# EAGLE design WIBL (EAGLE 9.6.2)

## Sheet 1 of 2: Main Logic/Microcontroller/Storage
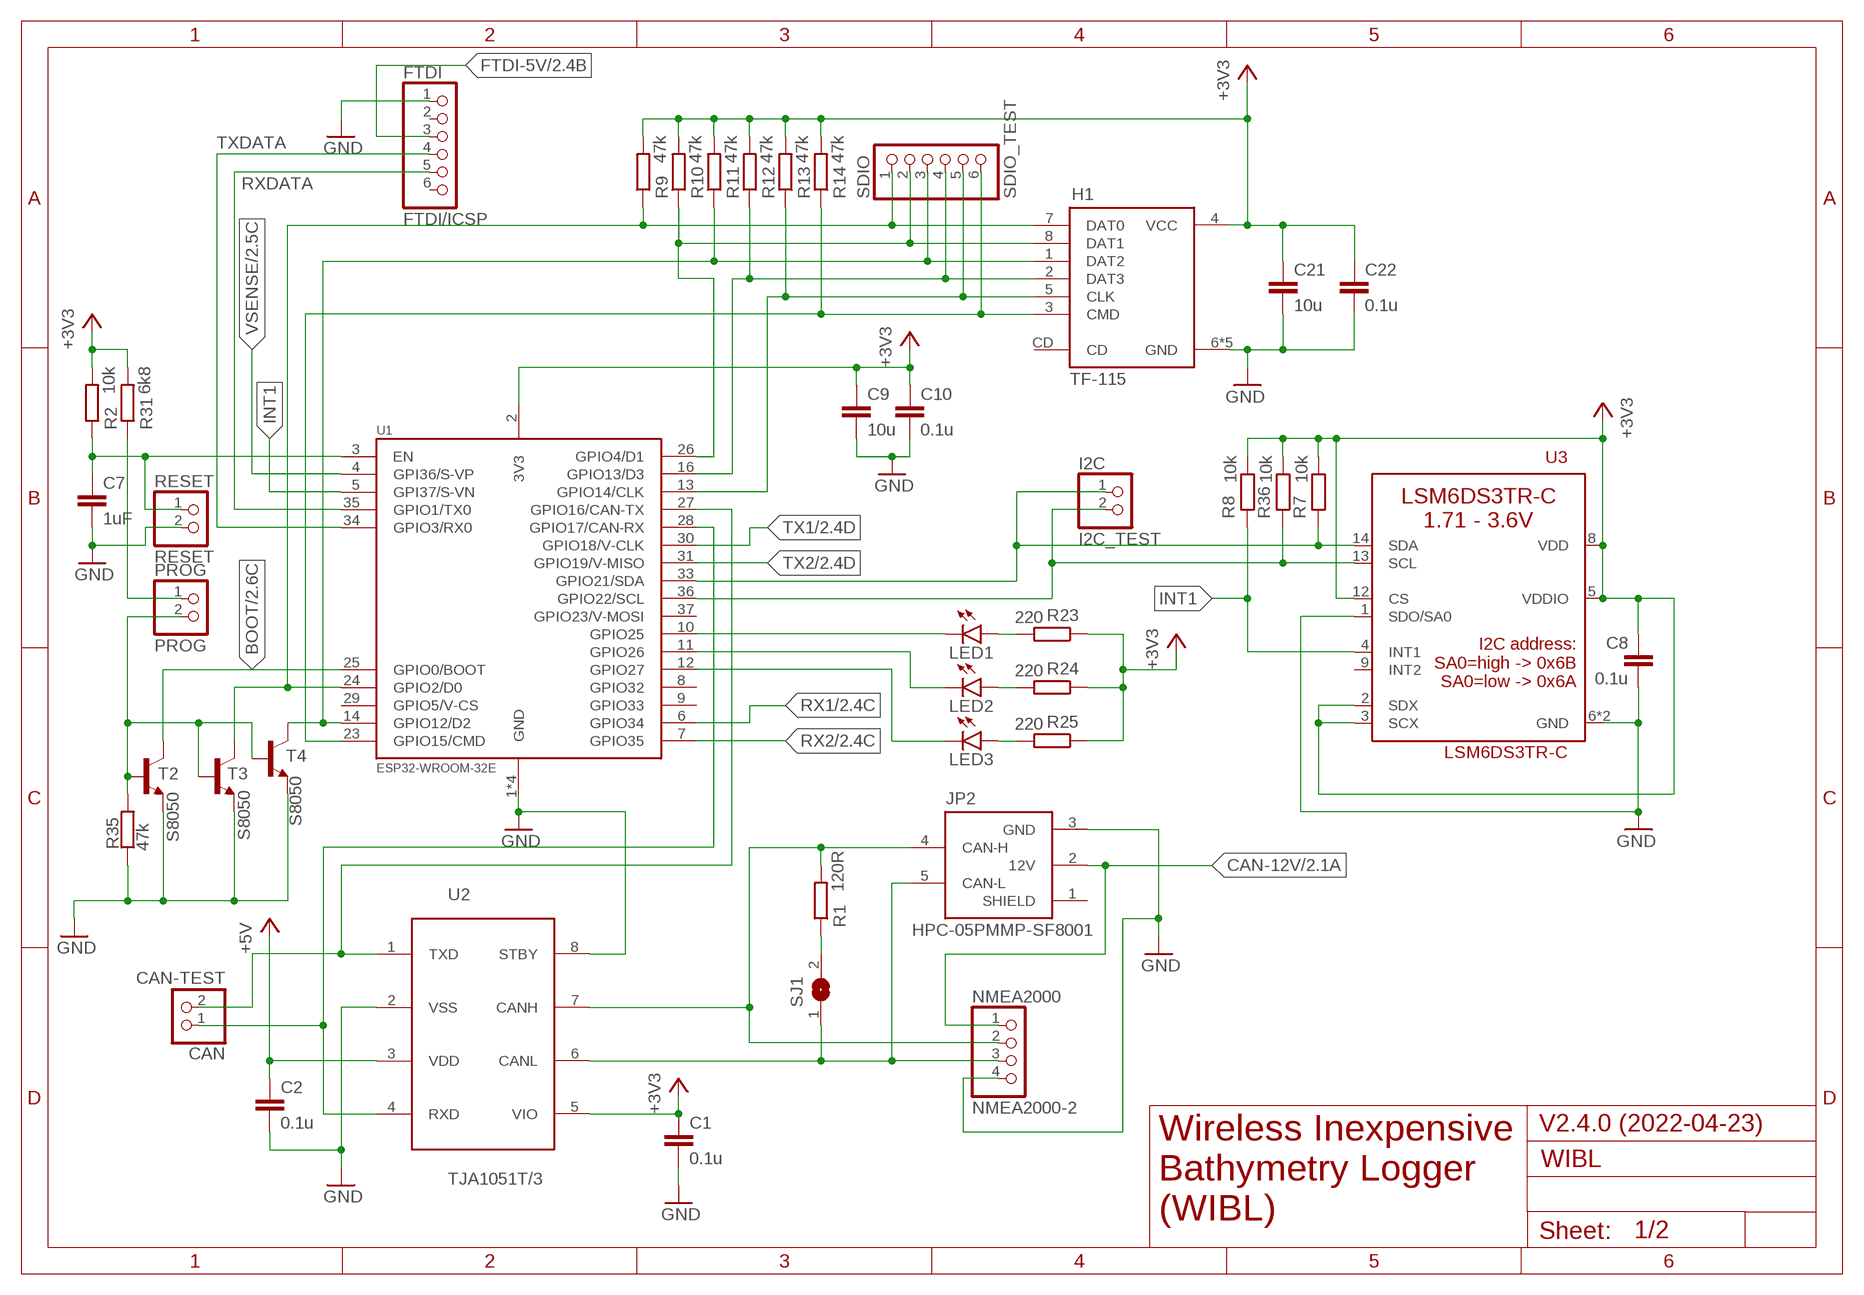
[diagram p0: schematic, sheet 1]

### Parts
C1  0.1u  C-EUC0805  [C0805]
C2  0.1u  C-EUC0805  [C0805]
C7  1uF  C-EUC0805  [C0805]
C8  0.1u  C-EUC0805  [C0805]
C9  10u  C-EUC0805  [C0805]
C10  0.1u  C-EUC0805  [C0805]
C21  10u  C-EUC0805  [C0805]
C22  0.1u  C-EUC0805  [C0805]
CAN  CAN-TEST  PINHD-1X2  [1X02]
FTDI  FTDI/ICSP  PINHD-1X6  [1X06]
H1  TF-115  XUNPU-MICROSD-SOCKET  [XUNPU-MICROSD-SOCKET]
I2C  I2C_TEST  PINHD-1X2  [1X02]
JP2  HPC-05PMMP-SF8001  NMEA2000  [NMEA2000]
LED1  LEDCHIP-LED0603  [CHIP-LED0603]
LED2  LEDCHIP-LED0603  [CHIP-LED0603]
LED3  LEDCHIP-LED0603  [CHIP-LED0603]
NMEA2000  NMEA2000-2  PINHD-1X4  [1X04]
PROG  PROG  PINHD-1X2  [1X02]
R1  120R  R-EU_R0805  [R0805]
R2  10k  R-EU_R0805  [R0805]
R7  10k  R-EU_R0805  [R0805]
R8  10k  R-EU_R0805  [R0805]
R9  47k  R-EU_R0805  [R0805]
R10  47k  R-EU_R0805  [R0805]
R11  47k  R-EU_R0805  [R0805]
R12  47k  R-EU_R0805  [R0805]
R13  47k  R-EU_R0805  [R0805]
R14  47k  R-EU_R0805  [R0805]
R23  220  R-EU_R0805  [R0805]
R24  220  R-EU_R0805  [R0805]
R25  220  R-EU_R0805  [R0805]
R31  6k8  R-EU_R0805  [R0805]
R35  47k  R-EU_R0805  [R0805]
R36  10k  R-EU_R0805  [R0805]
RESET  RESET  PINHD-1X2  [1X02]
SDIO  SDIO_TEST  PINHD-1X6  [1X06]
SJ1  SJ  [SJ]
T2  S8050  BC846  [SOT23]
T3  S8050  BC846  [SOT23]
T4  S8050  BC846  [SOT23]
U1  ESP32-WROOM-32E  [ESPS32-WROOM-32E]
U2  TJA1051T/3  MCP2562T-E/SN  [SOIC8]
U3  LSM6DS3TR-C  [LGA-14-2.5X3MM]

### Nets
+3V3: C1.1 C8.1 C9.1 C10.1 C21.1 C22.1 H1.4(VCC) R2.2 R7.2 R8.2 R9.2 R10.2 R11.2 R12.2 R13.2 R14.2 R23.1 R24.1 R25.1 R31.2 R36.2 U1.2(3V3) U2.5(VIO) U3.2(SDX) U3.3(SCX) U3.5(VDDIO) U3.8(VDD) U3.12(CS) ; also sheet 2
+5V: C2.1 U2.3(VDD) ; also sheet 2
BOOT: T2.3(C) U1.25(GPIO0/BOOT) ; also sheet 2
CAN-12V: JP2.2(12V) NMEA2000.1 ; also sheet 2
FTDI-5V: FTDI.3 ; also sheet 2
GND: C1.2 C2.2 C7.2 C8.2 C9.2 C10.2 C21.2 C22.2 FTDI.1 H1.6(GND) H1.GND1(GND) H1.GND2(GND) H1.GND3(GND) H1.GND4(GND) JP2.3(GND) NMEA2000.4 R35.1 RESET.2 T2.2(E) T3.2(E) T4.2(E) U1.1(GND) U1.15(GND) U1.38(GND) U1.THERM(GND) U2.2(VSS) U2.8(STBY) U3.1(SDO/SA0) U3.6(GND) U3.7(GND) ; also sheet 2
INT1: R8.1 U1.5(GPI37/S-VN) U3.4(INT1)
N$1: JP2.4(CAN-H) NMEA2000.2 R1.2 U2.7(CANH)
N$2: JP2.5(CAN-L) NMEA2000.3 SJ1.1 U2.6(CANL)
N$3: R1.1 SJ1.2
N$4: C7.1 R2.1 RESET.1 U1.3(EN)
N$6: CAN.2 U1.27(GPIO16/CAN-TX) U2.1(TXD)
N$7: CAN.1 U1.28(GPIO17/CAN-RX) U2.4(RXD)
N$10: H1.1(DAT2) R11.1 SDIO.3 T4.3(C) U1.14(GPIO12/D2)
N$11: H1.8(DAT1) R10.1 SDIO.2 U1.26(GPIO4/D1)
N$22: H1.7(DAT0) R9.1 SDIO.1 T3.3(C) U1.24(GPIO2/D0)
N$24: H1.2(DAT3) R12.1 SDIO.4 U1.16(GPIO13/D3)
N$25: H1.5(CLK) R13.1 SDIO.5 U1.13(GPIO14/CLK)
N$26: H1.3(CMD) R14.1 SDIO.6 U1.23(GPIO15/CMD)
N$35: LED1.C U1.10(GPIO25)
N$36: LED2.C U1.11(GPIO26)
N$37: PROG.2 R35.2 T2.1(B) T3.1(B) T4.1(B)
N$38: LED3.C U1.12(GPIO27)
N$39: LED1.A R23.2
N$40: LED2.A R24.2
N$43: PROG.1 R31.1
N$44: LED3.A R25.2
RX1: U1.6(GPIO34) ; also sheet 2
RX2: U1.7(GPIO35) ; also sheet 2
RXDATA: FTDI.5 U1.35(GPIO1/TX0)
SCL: I2C.1 R7.1 U1.33(GPIO21/SDA) U3.14(SDA)
SDA: I2C.2 R36.1 U1.36(GPIO22/SCL) U3.13(SCL)
TX1: U1.30(GPIO18/V-CLK) ; also sheet 2
TX2: U1.31(GPIO19/V-MISO) ; also sheet 2
TXDATA: FTDI.4 U1.34(GPIO3/RX0)
VSENSE: U1.4(GPI36/S-VP) ; also sheet 2
Unconnected: FTDI.2 FTDI.6 H1.CD JP2.1(SHIELD) U1.8(GPIO32) U1.9(GPIO33) U1.29(GPIO5/V-CS) U1.37(GPIO23/V-MOSI) U3.9(INT2)

### Notes on the sheet
- V2.4.0 (2022-04-23)
- Wireless Inexpensive
  Bathymetry Logger
  (WIBL)

## Sheet 2 of 2: NMEA0183 Transceiver/Power Section
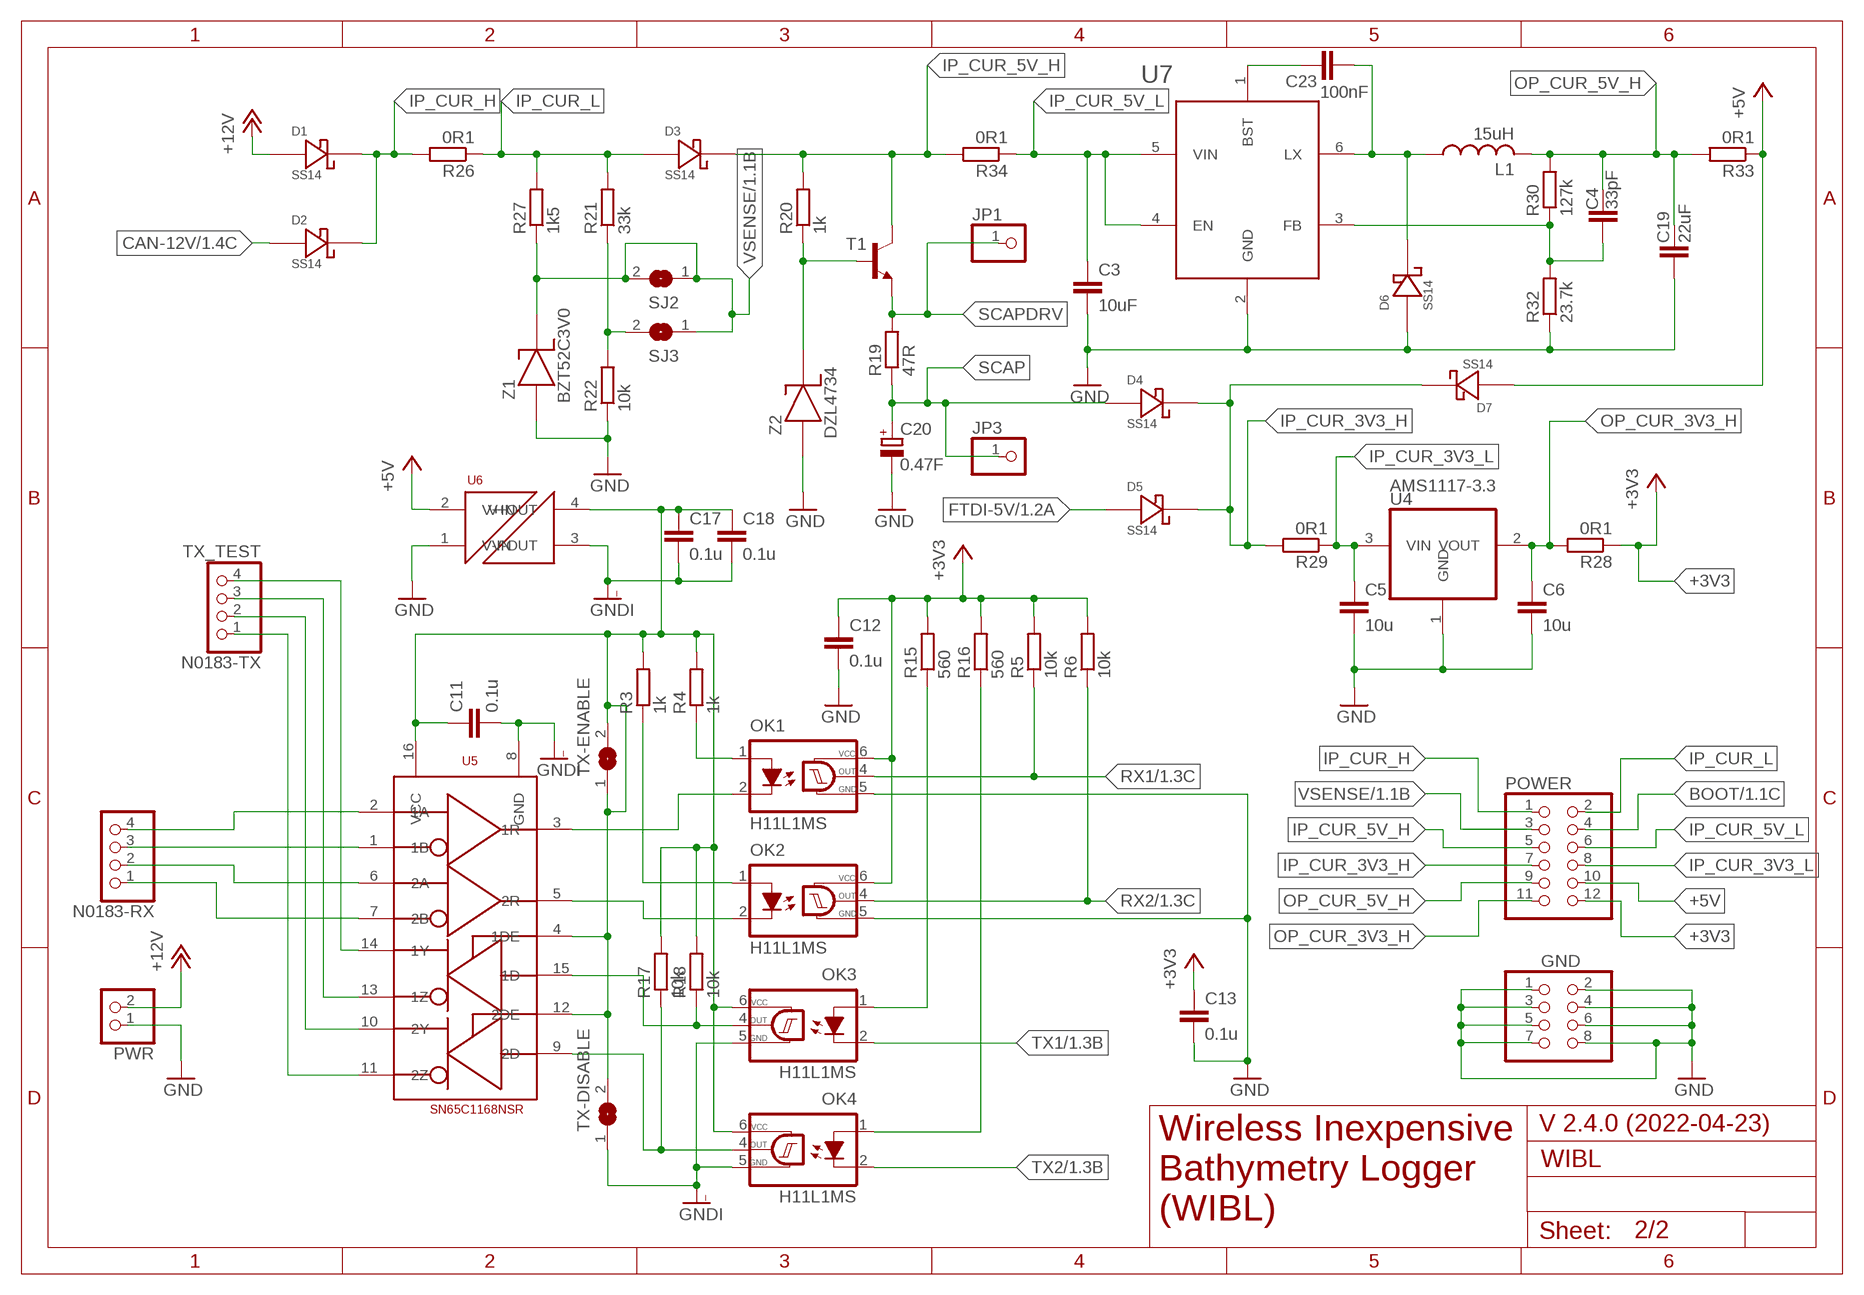
[diagram p1: schematic, sheet 2]

### Parts
C3  10uF  C-EUC1206  [C1206]
C4  33pF  C-EUC0603  [C0603]
C5  10u  C-EUC0805  [C0805]
C6  10u  C-EUC0805  [C0805]
C11  0.1u  C-EUC0805  [C0805]
C12  0.1u  C-EUC0805  [C0805]
C13  0.1u  C-EUC0805  [C0805]
C17  0.1u  C-EUC0805  [C0805]
C18  0.1u  C-EUC0805  [C0805]
C19  22uF  C-EUC0603  [C0603]
C20  0.47F  CPOL-EUP128-50  [P128-50]
C23  100nF  C0402  [C0402]
D1  SS14  [DO-214AC]
D2  SS14  [DO-214AC]
D3  SS14  [DO-214AC]
D4  SS14  [DO-214AC]
D5  SS14  [DO-214AC]
D6  SS14  [DO-214AC]
D7  SS14  [DO-214AC]
GND  PINHD-2X4  [2X04]
JP1  PINHD-1X1  [1X01]
JP3  PINHD-1X1  [1X01]
L1  15uH  MWSA0603S  [MWSA0603S]
N0183-RX  PINHD-1X4  [1X04]
N0183-TX  TX_TEST  PINHD-1X4  [1X04]
OK1  H11L1MS  [DIL6-SMD]
OK2  H11L1MS  [DIL6-SMD]
OK3  H11L1MS  [DIL6-SMD]
OK4  H11L1MS  [DIL6-SMD]
POWER  PINHD-2X6  [2X06]
PWR  PINHD-1X2  [1X02]
R3  1k  R-EU_R0805  [R0805]
R4  1k  R-EU_R0805  [R0805]
R5  10k  R-EU_R0805  [R0805]
R6  10k  R-EU_R0805  [R0805]
R15  560  R-EU_R0805  [R0805]
R16  560  R-EU_R0805  [R0805]
R17  10k  R-EU_R0805  [R0805]
R18  10k  R-EU_R0805  [R0805]
R19  47R  R-EU_R0805  [R0805]
R20  1k  R-EU_R0805  [R0805]
R21  33k  R-EU_R0805  [R0805]
R22  10k  R-EU_R0805  [R0805]
R26  0R1  R-EU_R0603  [R0603]
R27  1k5  R-EU_R0805  [R0805]
R28  0R1  R-EU_R0603  [R0603]
R29  0R1  R-EU_R0603  [R0603]
R30  127k  R-EU_R0603  [R0603]
R32  23.7k  R-EU_R0603  [R0603]
R33  0R1  R-EU_R0603  [R0603]
R34  0R1  R-EU_R0603  [R0603]
SJ2  SJ  [SJ]
SJ3  SJ  [SJ]
T1  BC817-16-NPN-SOT23-BEC  [SOT23-BEC]
TX-DISABLE  SJ  [SJ]
TX-ENABLE  SJ  [SJ]
U4  AMS1117-3.3  REG1117  [SOT223]
U5  SN65C1168NSR  SN65C1168-SOIC  [SOIC16]
U6  RFM-0505S  [RFM-0505S]
U7  BL9352A  [SOT-23-6L]
Z1  BZT52C3V0  [SOD123]
Z2  DZL4734  [SOD-123FL]

### Nets
+3V3: C12.1 C13.1 OK1.6(VCC) OK2.6(VCC) POWER.12 R5.2 R6.2 R15.2 R16.2 R28.1 ; also sheet 1
+5V: D7.A POWER.10 R33.1 U6.2(V+IN) ; also sheet 1
+12V: D1.A PWR.2
BOOT: POWER.4 ; also sheet 1
CAN-12V: D2.A ; also sheet 1
FTDI-5V: D5.A ; also sheet 1
GND: C3.2 C5.2 C6.2 C12.2 C13.2 C19.1 C20.- D6.A GND.1 GND.2 GND.3 GND.4 GND.5 GND.6 GND.7 GND.8 OK1.5(GND) OK2.5(GND) PWR.1 R22.1 R32.1 U4.1(GND) U6.1(V-IN) U7.2(GND) Z1.1(A) Z2.A ; also sheet 1
GNDI: C11.2 C17.2 C18.2 OK3.5(GND) OK4.5(GND) TX-DISABLE.1 U5.8(GND) U6.3(V-OUT)
IP_CUR_3V3_H: D4.K D5.K D7.K POWER.7 R29.2
IP_CUR_3V3_L: C5.1 POWER.8 R29.1 U4.3(VIN)
IP_CUR_5V_H: D3.K POWER.5 R20.2 R34.2 T1.C
IP_CUR_5V_L: C3.1 POWER.6 R34.1 U7.4(EN) U7.5(VIN)
IP_CUR_H: D1.K D2.K POWER.1 R26.2
IP_CUR_L: D3.A POWER.2 R21.2 R26.1 R27.2
N$13: OK1.2(C) U5.3(1R)
N$14: OK2.2(C) U5.5(2R)
N$15: OK1.1(A) R4.1
N$16: OK2.1(A) R3.1
N$17: N0183-RX.4 U5.2(1A)
N$18: N0183-RX.3 U5.1(1B)
N$19: N0183-RX.2 U5.6(2A)
N$20: N0183-RX.1 U5.7(2B)
N$21: C11.1 C17.1 C18.1 OK3.6(VCC) OK4.6(VCC) R3.2 R4.2 R17.2 R18.2 TX-DISABLE.2 TX-ENABLE.1 TX-ENABLE.2 U5.4(1DE) U5.12(2DE) U5.16(VCC) U6.4(V+OUT)
N$27: N0183-TX.4 U5.14(1Y)
N$28: N0183-TX.3 U5.13(1Z)
N$29: N0183-TX.2 U5.10(2Y)
N$30: N0183-TX.1 U5.11(2Z)
N$31: OK3.1(A) R15.1
N$32: OK4.1(A) R16.1
N$33: OK3.4(OUT) R18.1 U5.15(1D)
N$34: OK4.4(OUT) R17.1 U5.9(2D)
N$41: R20.1 T1.B Z2.K
N$42: C23.P$1 U7.1(BST)
N$45: C23.P$2 D6.K L1.P$1 U7.6(LX)
N$46: R21.1 R22.2 SJ3.2
N$48: C4.1 R30.1 R32.2 U7.3(FB)
OP_CUR_3V3_H: C6.1 POWER.11 R28.2 U4.2(VOUT)
OP_CUR_5V_H: C4.2 C19.2 L1.P$2 POWER.9 R30.2 R33.2
RX1: OK1.4(OUT) R5.1 ; also sheet 1
RX2: OK2.4(OUT) R6.1 ; also sheet 1
SCAP: C20.+ D4.A JP3.1 R19.1
SCAPDRV: JP1.1 R19.2 T1.E
TX1: OK3.2(C) ; also sheet 1
TX2: OK4.2(C) ; also sheet 1
VSENSE: POWER.3 R27.1 SJ2.1 SJ2.2 SJ3.1 Z1.2(K) ; also sheet 1

### Notes on the sheet
- V 2.4.0 (2022-04-23)
- Wireless Inexpensive
  Bathymetry Logger
  (WIBL)

## Library data of the parts
C1-C13 C17-C19 C21 C22 = rcl:C-EU: CAPACITOR, European symbol; SPICEPREFIX: C
C20 = rcl:CPOL-EU: POLARIZED CAPACITOR, European symbol; SPICEPREFIX: C
C23 = sb2030_logger:C0402
CAN I2C PROG PWR RESET = pinhead:PINHD-1X2: PIN HEADER
D1-D7 = sb2030_logger:SS14
FTDI SDIO = pinhead:PINHD-1X6: PIN HEADER
GND = pinhead:PINHD-2X4: PIN HEADER
H1 = sb2030_logger:XUNPU-MICROSD-SOCKET: Micro-SD push-push card holder; LCSC C266620, Manufacturer TF-115 (XunPu)
JP1 JP3 = pinhead:PINHD-1X1: PIN HEADER
JP2 = sb2030_logger:NMEA2000
L1 = sb2030_logger:MWSA0603S
LED1-LED3 = led:LED: LED OSRAM: - CHIPLED LG R971, LG N971, LY N971, LG Q971, LY Q971, LO R971, LY R971 LH N974, LH R974 LS Q976, LO Q976, LY Q976 LO Q996 - Hyper CHIPLED LW Q18S LB Q993, LB Q99A, LB R99A - SideLED LS A670, LO A670, LY A670, LG A670, LP A670 LB A673, LV A673, LT A673, LW A673 LH A674 LY A675 LS A676, LA A676, LO A676, LY A676, LW A676 LS A679, LY A679, LG A679 - Hyper Micro SIDELED® LS Y876, LA Y876, LO Y876, LY Y876 LT Y87S - SmartLED LW L88C, LW L88S LB L89C, LB L89S, LG L890 LS L89K, LO L89K, LY L89K LS L896, LA L896, LO L896, LY L896 - TOPLED LS T670, LO T670, LY T670, LG T670, LP T670 LSG T670, LSP T670, LSY T670, LOP T670, LYG T670 LG T671, LOG T671, LSG T671 LB T673, LV T673, LT T673, LW T673 LH T674 LS T676, LA T676, LO T676, LY T676, LB T676, LH T676, LSB T676, LW T676 LB T67C, LV T67C, LT T67C, LS T67K, LO T67K, LY T67K, LW E67C LS E67B, LA E67B, LO E67B, LY E67B, LB E67C, LV E67C, LT E67C LW T67C LS T679, LY T679, LG T679 LS T770, LO T770, LY T770, LG T770, LP T770 LB T773, LV T773, LT T773, LW T773 LH T774 LS E675, LA E675, LY E675, LS T675 LS T776, LA T776, LO T776, LY T776, LB T776 LHGB T686 LT T68C, LB T68C - Hyper Mini TOPLED® LB M676 - Mini TOPLED Santana® LG M470 LS M47K, LO M47K, LY M47K Source: http://www.osram.convergy.de LUXEON: - LUMILED® LXK2-PW12-R00, LXK2-PW12-S00, LXK2-PW14-U00, LXK2-PW14-V00 LXK2-PM12-R00, LXK2-PM12-S00, LXK2-PM14-U00 LXK2-PE12-Q00, LXK2-PE12-R00, LXK2-PE12-S00, LXK2-PE14-T00, LXK2-PE14-U00 LXK2-PB12-K00, LXK2-PB12-L00, LXK2-PB12-M00, LXK2-PB14-N00, LXK2-PB14-P00, LXK2-PB14-Q00 LXK2-PR12-L00, LXK2-PR12-M00, LXK2-PR14-Q00, LXK2-PR14-R00 LXK2-PD12-Q00, LXK2-PD12-R00, LXK2-PD12-S00 LXK2-PH12-R00, LXK2-PH12-S00 LXK2-PL12-P00, LXK2-PL12-Q00, LXK2-PL12-R00 Source: www.luxeon.com KINGBRIGHT: KA-3528ASYC Source: www.kingbright.com
N0183-RX N0183-TX NMEA2000 = pinhead:PINHD-1X4: PIN HEADER
OK1-OK4 = optocoupler:H11L*M: 6-Pin DIP Optocoupler Source: http://www.fairchildsemi.com/ds/H1/H11L2-M.pdf; OC_FARNELL: unknown; OC_NEWARK: unknown
POWER = pinhead:PINHD-2X6: PIN HEADER
R1-R36 = rcl:R-EU_: RESISTOR, European symbol; SPICEPREFIX: R
SJ1-SJ3 TX-DISABLE TX-ENABLE = jumper:SJ: SMD solder JUMPER
T1 = transistor:*-NPN-: NPN Transistror BF959 corrected 2008.03.06
T2-T4 = transistor:BC846: NPN TRANSISTOR
U1 = sb2030_logger:ESP32-WROOM-32E
U2 = sb2030_logger:MCP2562T-E/SN: This is the SMD version of the MCP2562 CAN bus transceiver with Vio pin for digitial IO voltage selection
U3 = LSM6DS3TR-C:LSM6DS3TR-C: Check availability <https://pricing.snapeda.com/parts/LSM6DS3TR-C/STMicroelectronics/view-part?ref=eda>; AVAILABILITY: In Stock; DESCRIPTION: IMUs - Inertial Measurement Units iNEMO 6DoF inertial module, for entry level / mid-tier smart phones and Portable PC platforms; MF: STMicroelectronics; MP: LSM6DS3TR-C; PACKAGE: None; PRICE: None; PURCHASE-URL: https://pricing.snapeda.com/search/part/LSM6DS3TR-C/?ref=eda
U4 = burr-brown:REG1117: 800mA and 1A Low Dropout (LDO) Positive Regulator 1.8V, 2.5V, 2.85V, 3.3V, 5V, and Adj; MPN: REG1117; OC_FARNELL: 1097566; OC_NEWARK: 14P6981
U5 = sb2030_logger:SN65C1168-SOIC
U6 = sb2030_logger:RFM-0505S
U7 = sb2030_logger:BL9352A
Z1 = sb2030_logger:BZT52C3V0
Z2 = sb2030_logger:DZL4734

## Board
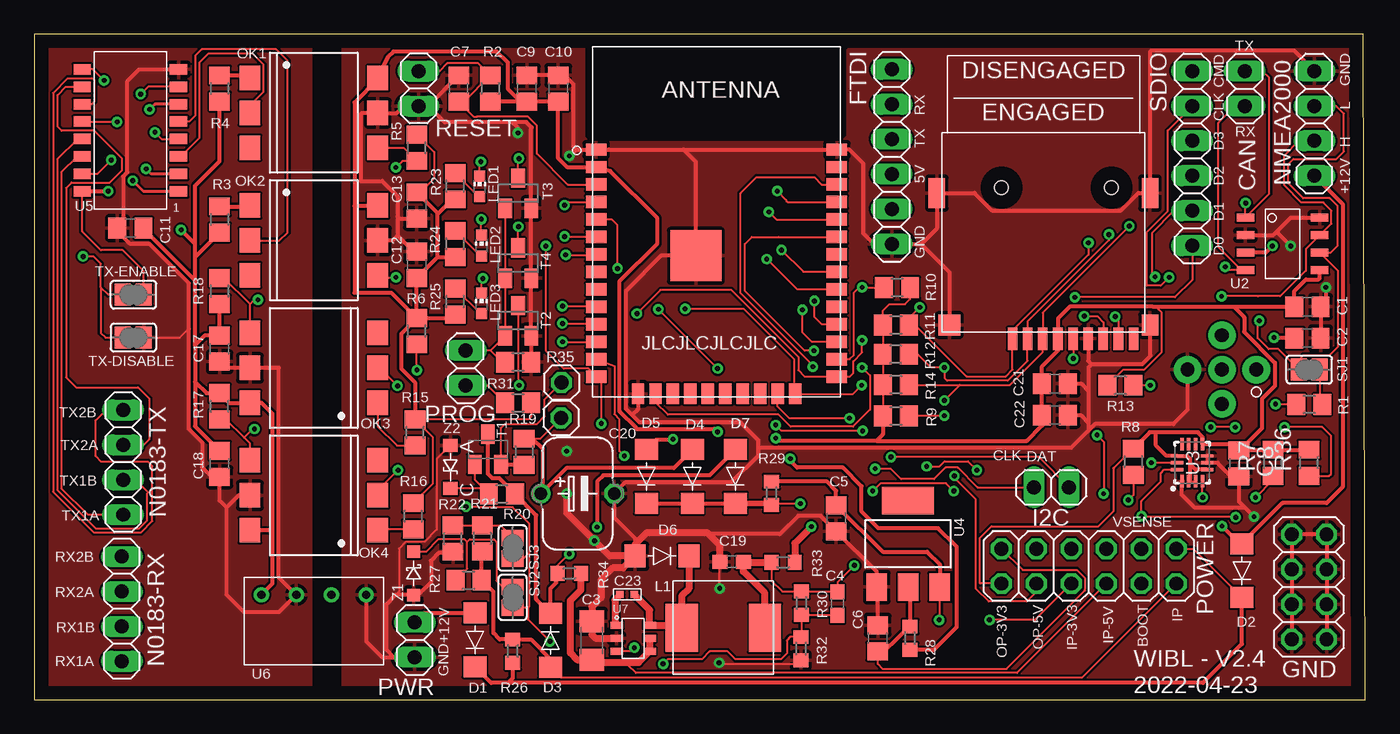
[diagram p2: board, top side]
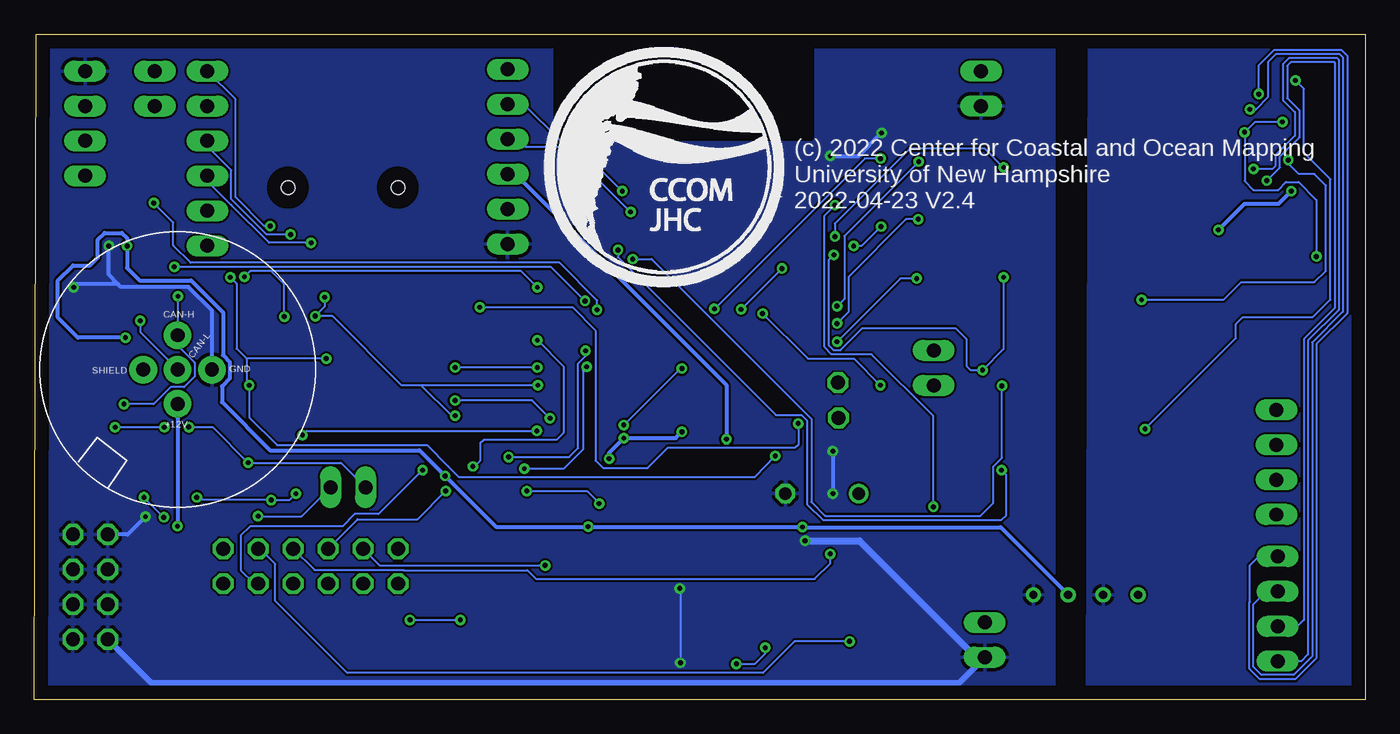
[diagram p3: board, bottom side, seen from below]

Size 96.77 x 48.39 mm. Coordinates in mm from the lower left corner, seen from the top.
Outline: 0,0 96.77,0 96.62,48.39 0,48.39 0,0
Copper layers (1*16): Top 0.035mm / dielectric 1.5mm / Bottom 0.035mm
Design rules "default": minimum track width 6mil, minimum drill 0.35mm, track to track 6mil, track to pad 6mil, pad to pad 6mil, via to via 6mil, smd to smd 6mil, copper to edge 40mil, drill to drill 6mil, minimum pad ring 10mil, minimum via ring 8mil, stop-mask expansion 4mil, vias tented up to drill 0mil, thermal gap 10mil

### Footprints (pad centres in the part's own frame; a part is rotated, then mirrored left to right if it is on the bottom)
C0805 = smd 1.3 x 1.5: 1 -0.95,0; 2 0.95,0
C1206 = smd 1.6 x 1.8: 1 -1.4,0; 2 1.4,0
C0603 = smd 1.1 x 1: 1 -0.85,0; 2 0.85,0
P128-50 = drill 0.914: + -2.667,0 | drill 0.914 octagon: - 2.667,0
C0402 = smd 0.55 x 0.5: P$1 -0.525,0; P$2 0.525,0
1X02 = drill 1.016 long: 1 -1.27,0; 2 1.27,0
DO-214AC = smd 1.524 x 1.676: A 1.956,0; K -1.956,0
1X06 = drill 1.016 long: 1 -6.35,0; 2 -3.81,0; 3 -1.27,0; 4 1.27,0; 5 3.81,0; 6 6.35,0
2X04 = drill 1.016 octagon: 1 -3.81,-1.27; 2 -3.81,1.27; 3 -1.27,-1.27; 4 -1.27,1.27; 5 1.27,-1.27; 6 1.27,1.27; 7 3.81,-1.27; 8 3.81,1.27
XUNPU-MICROSD-SOCKET = smd 0.7 x 1.6: 1 2.25,7.475; 2 1.15,7.475; 3 0.05,7.475; 4 -1.05,7.475; 5 -2.15,7.475; 6 -3.25,7.475; 7 -4.35,7.475; 8 -5.45,7.475; CD -6.55,7.475 | smd 1.2 x 1.5: GND1 -7.75,6.475 | smd 1.2 x 2.2: GND2 -7.75,-3.125; GND3 7.75,-3.125 | smd 1.6 x 1.5: GND4 6.85,6.475 | hole 1: -4.95,-3.525; 3.05,-3.525
1X01 = drill 1.016 octagon: 1 0,0
NMEA2000 = drill 1 pad 2: 1 2.5,0; 2 0,-2.5; 3 -2.5,0; 4 0,2.5; 5 0,0
MWSA0603S = smd 2.35 x 3.5: P$1 -3.025,0; P$2 3.025,0
CHIP-LED0603 = smd 0.8 x 0.8: A 0,-0.75; C 0,0.75
1X04 = drill 1.016 long: 1 -3.81,0; 2 -1.27,0; 3 1.27,0; 4 3.81,0
DIL6-SMD = smd 1.78 x 1.52: 1 -2.54,-4.645; 2 0,-4.645; 3 2.54,-4.645; 4 2.54,4.645; 5 0,4.645; 6 -2.54,4.645
2X06 = drill 1.016 octagon: 1 -6.35,-1.27; 2 -6.35,1.27; 3 -3.81,-1.27; 4 -3.81,1.27; 5 -1.27,-1.27; 6 -1.27,1.27; 7 1.27,-1.27; 8 1.27,1.27; 9 3.81,-1.27; 10 3.81,1.27; 11 6.35,-1.27; 12 6.35,1.27
R0805 = smd 1.3 x 1.5: 1 -0.95,0; 2 0.95,0
R0603 = smd 1 x 1.1: 1 -0.85,0; 2 0.85,0
SJ = smd 1.168 x 1.6: 1 -0.762,0; 2 0.762,0
SOT23-BEC = smd 1 x 1.4: B -0.95,-1.1; C 0,1.1; E 0.95,-1.1
SOT23 = smd 1 x 1.4: 1 -0.95,-1.1; 2 0.95,-1.1; 3 0,1.1
ESPS32-WROOM-32E = smd 1.5 x 0.9: 1 -8.75,8.34; 2 -8.75,7.07; 3 -8.75,5.8; 4 -8.75,4.53; 5 -8.75,3.26; 6 -8.75,1.99; 7 -8.75,0.72; 8 -8.75,-0.55; 9 -8.75,-1.82; 10 -8.75,-3.09; 11 -8.75,-4.36; 12 -8.75,-5.63; 13 -8.75,-6.9; 14 -8.75,-8.17; 25 8.75,-8.17; 26 8.75,-6.9; 27 8.75,-5.63; 28 8.75,-4.36; 29 8.75,-3.09; 30 8.75,-1.82; 31 8.75,-0.55; 32 8.75,0.72; 33 8.75,1.99; 34 8.75,3.26; 35 8.75,4.53; 36 8.75,5.8; 37 8.75,7.07; 38 8.75,8.34 | smd 0.9 x 1.5: 15 -5.71,-9.42; 16 -4.44,-9.42; 17 -3.17,-9.42; 18 -1.9,-9.42; 19 -0.63,-9.42; 20 0.64,-9.42; 21 1.91,-9.42; 22 3.18,-9.42; 23 4.45,-9.42; 24 5.71,-9.42 | smd 3.7 x 3.7: THERM -1.5,0.62
SOIC8 = smd 0.6 x 1.27: 1 -1.905,-2.7; 2 -0.635,-2.7; 3 0.635,-2.7; 4 1.905,-2.7; 5 1.905,2.7; 6 0.635,2.7; 7 -0.635,2.7; 8 -1.905,2.7
LGA-14-2.5X3MM = smd 0.9 x 0.25: 1 -1.35,0.75; 2 -1.35,0.25; 3 -1.35,-0.25; 4 -1.35,-0.75; 8 1.35,-0.75; 9 1.35,-0.25; 10 1.35,0.25; 11 1.35,0.75 | smd 0.25 x 0.9: 5 -0.5,-1.1; 6 0,-1.1; 7 0.5,-1.1; 12 0.5,1.1; 13 0,1.1; 14 -0.5,1.1
SOT223 = smd 1.499 x 2.007: 1 -2.261,-3.15; 2 0.025,-3.15; 3 2.311,-3.15 | smd 3.81 x 2.007: 4 0,3.15
SOIC16 = smd 1.27 x 0.762: 1 -3.505,5.08; 2 -3.505,3.81; 3 -3.505,2.54; 4 -3.505,1.27; 5 -3.505,0; 6 -3.505,-1.27; 7 -3.505,-2.54; 8 -3.505,-3.81; 9 3.505,-3.81; 10 3.505,-2.54; 11 3.505,-1.27; 12 3.505,0; 13 3.505,1.27; 14 3.505,2.54; 15 3.505,3.81; 16 3.505,5.08
RFM-0505S = drill 0.6: 1 -3.81,0; 2 -1.27,0; 3 1.27,0; 4 3.81,0
SOT-23-6L = smd 0.9 x 0.5: 1 -1.2,0.95; 2 -1.2,0; 3 -1.2,-0.95; 4 1.2,-0.95; 5 1.2,0; 6 1.2,0.95
SOD123 = smd 0.9 x 0.95: 1 -1.575,0; 2 1.575,0
SOD-123FL = smd 0.95 x 1.05: A -1.575,0; K 1.575,0

### Placement (x,y rotation side)
C1  92.58,28.57 0 top
C2  92.58,26.29 0 top
C3  40.54,4.31 90 top
C4  58.41,6.97 90 top
C5  58.31,13.18 270 top
C6  61.33,4.46 90 top
C7  30.86,44.45 90 top
C8  87.59,17.18 270 top
C9  35.81,44.45 90 top
C10  38.1,44.45 90 top
C11  6.99,34.29 180 top
C12  27.81,31.62 90 top
C13  27.81,35.94 270 top
C17  13.46,25.53 270 top
C18  13.46,17.14 270 top
C19  50.71,10.02 0 top
C20  39.5,14.99 0 top
C21  74.22,22.97 0 top
C22  74.22,20.69 0 top
C23  43.1,7.65 0 top
CAN  88.01,44.45 90 top
D1  32.04,4.34 90 top
D2  87.82,9.37 90 top
D3  37.53,4.31 270 top
D4  47.85,16.23 90 top
D5  44.5,16.23 90 top
D6  45.64,10.44 180 top
D7  50.98,16.23 90 top
FTDI  62.36,39.5 90 top
GND  92.7,8.19 90 top
H1  73.38,33.72 180 top
I2C  73.96,15.44 180 top
JP1  38.33,23.05 0 top
JP2  86.36,24 0 top
JP3  38.29,20.5 0 top
L1  50.1,5.22 0 top
LED1  32.38,37.34 0 top
LED2  32.51,33.02 0 top
LED3  32.51,28.83 0 top
N0183-RX  6.36,6.59 270 top
N0183-TX  6.45,17.26 270 top
NMEA2000  93.09,41.91 90 top
OK1  20.32,42.67 270 top
OK2  20.32,33.4 270 top
OK3  20.32,24.13 90 top
OK4  20.32,14.86 90 top
POWER  76.68,9.7 180 top
PROG  31.37,24.13 90 top
PWR  27.66,4.34 90 top
R1  92.71,21.46 180 top
R2  33.15,44.45 270 top
R3  13.46,34.92 270 top
R4  13.46,44.45 270 top
R5  27.81,40.13 90 top
R6  27.81,26.8 90 top
R7  90.07,17.22 90 top
R8  79.92,17.3 90 top
R9  62.65,20.62 180 top
R10  62.74,29.97 0 top
R11  62.65,27.24 180 top
R12  62.64,25.11 180 top
R13  78.98,22.86 180 top
R14  62.66,22.9 180 top
R15  27.69,19.43 90 top
R16  27.56,13.34 90 top
R17  13.46,21.34 90 top
R18  13.46,29.72 270 top
R19  35.61,18.02 270 top
R20  34,14.96 0 top
R21  32.58,11.72 270 top
R22  30.44,11.71 90 top
R23  30.61,37.34 90 top
R24  30.61,33.15 90 top
R25  30.61,28.96 90 top
R26  34.79,3.52 270 top
R27  31.58,8.69 0 top
R28  63.68,4.46 90 top
R29  53.61,15 270 top
R30  55.78,7.01 90 top
R31  35.18,21.59 0 top
R32  55.74,3.7 90 top
R33  54.44,9.98 180 top
R34  38.9,9.18 180 top
R35  35.17,24.54 180 top
R36  92.7,17.22 90 top
RESET  27.94,44.45 270 top
SDIO  84.2,39.37 90 top
SJ1  92.71,24 0 top
SJ2  34.79,7.43 90 top
SJ3  34.79,11.01 90 top
T1  32.98,18.2 0 top
T2  35.18,27.56 0 top
T3  35.18,36.83 0 top
T4  35.18,31.75 0 top
TX-DISABLE  7.2,26.33 180 top
TX-ENABLE  7.2,29.45 0 top
U1  49.61,31.66 0 top
U2  90.77,33.15 270 top
U3  84.2,17.22 90 top
U4  63.53,11.33 0 top
U5  6.99,42.04 180 top
U6  20.32,7.62 180 top
U7  43.55,4.46 0 top
Z1  27.58,9.18 90 top
Z2  30.25,16.92 270 top

### Tracks (layer width: path | path; a pad name or v marks a point on that pad's centre or on a via)
+3V3  (via drill 0.35)
  Top 0.152: R31.2 36.13,20.58 35.93,20.38 R15.2 28.96,19.11 28.96,15.68 R16.2 | R5.2 29.07,39.83 29.07,37.91 27.93,36.77 | R13.2 79.17,24 80.7,24 81.98,25.29 81.98,28.14 81.76,28.37 | 81.76,28.37 81.76,28.57 | 81.76,28.37 81.55,28.57 81.34,28.57 | POWER.12 68.77,8.43 68.77,11.77 69.61,12.61 77.38,12.61 78.45,13.68 78.45,16.84 78.51,16.84 R8.2 | R9.2 61.71,20.64 R14.2 61.71,25.08 R12.2 61.72,25.14 61.72,27.22 R11.2 61.7,28.29 62.18,28.77 63.32,28.77 63.69,29.13 R10.2 | C8.1 87.61,18.15 87.63,18.17 87.71,18.17 | U3.2 84.01,15.87 U3.3
  Top 0.305: 23.28,35.9 23.28,43.43 24.96,45.12 OK1.6 25.7,46.73 26.11,47.14 33.63,47.14 34.42,46.35 34.42,44.45 35.37,43.5 C9.1 | 23.28,35.9 24.93,35.9 OK2.6 | R6.2 C12.1 29.34,32.2 | 23.28,35.9 23.28,29.6 25.96,29.6 R6.2 | 29.34,32.2 29.34,35.37 | 29.34,35.37 27.93,36.77 C13.1 | R6.2 26.67,26.6 26.67,24.08 27.69,23.06 R15.2 | 61.23,18.82 54.1,18.82 v53.91,19.01 | 87.21,28.57 81.76,28.57 81.34,28.57 75.29,28.57 74.43,27.72 H1.4 74.43,25.4 73.27,24.23 C21.1 C22.1 73.27,19.93 72.16,18.82 61.23,18.82 | 87.21,28.57 C1.1 91.63,29.72 92.47,30.56 93.38,30.56 93.47,30.64 U2.5 | 87.21,28.57 87.97,27.81 87.97,26.75 90.22,24.5 90.22,22.82 89.27,21.87 89.27,19.73 87.71,18.17 R7.2 R36.2 | R9.2 61.7,19.29 61.23,18.82 | C9.1 C10.1 38.1,39.37 38.73,38.73 U1.2 41.87,38.44 45.3,35.01 45.3,33.19 42.56,30.44 42.56,20.96 43.78,19.74 43.78,19.7 49.45,19.7 v49.68,19.47 | C9.1 R2.2 | v54.98,17.53 54.98,17.37 55.47,16.88 58.79,16.88 60.16,15.51 60.16,13.68 61.38,12.46 65.72,12.46 67.06,11.12 67.06,5.26 65.41,3.61 R28.1 | 29.34,32.2 R24.1 | 87.19,18.57 87.61,18.15 | R6.2 30.35,27.75 R25.1 | 29.34,35.37 29.39,35.37 30.41,36.39 R23.1 | 84.01,17.14 84.01,17.53 83.81,17.72 U3.12 82.33,17.72 81.57,18.48 81.57,19.43 | 84.01,17.14 84.01,15.87 | U3.5 84.43,16.72 84.01,17.14 | 87.16,18.57 C8.1 | C8.1 87.15,18.57 U3.8 84.95,19.1 84.62,19.43 81.57,19.43 | 81.57,19.43 81.11,19.43 R8.2
  Bottom 0.305: v49.68,19.47 50.14,19.01 v53.91,19.01 54.98,17.95 v54.98,17.53
+5V  (via drill 0.35)
  Top 0.152: POWER.10 72.87,7.84 72.16,7.12 69.41,7.12 68.47,8.06 68.47,14.55 66.83,16.19
  Top 0.305: 66.83,16.19 v66.9,16.27 | v90.14,26.33 91.59,26.33 C2.1 | v90.03,32.99 89.55,32.51 U2.3 | D7.A 49.1,16.31 41.38,16.31 40.92,15.85 v40.92,12.54
  Top 0.508: v56.5,12.57 55.3,11.37 R33.1
  Bottom 0.305: v90.14,26.33 93.61,26.33 95.06,27.77 95.06,30.48 93.95,31.59 92.73,31.59 92.16,32.16 92.16,33.45 91.67,33.95 90.41,33.95 90.03,33.57 v90.03,32.99 90.03,31.39 89.12,30.48 85.38,30.48 83.06,28.16 83.06,25.05 82.56,24.54 82.56,23.36 83.13,22.78 83.13,21.64 79.63,18.14 68.77,18.14 v66.9,16.27 63.21,12.57 v56.5,12.57 40.96,12.57 v40.92,12.54 26.5,12.54 U6.2
+12V
  Top 0.305: PWR.2 28.35,6.3 D1.A
BOOT  (via drill 0.35)
  Top 0.152: T2.3 35.18,23.18 35.2,23.16 35.2,22.9 v35.25,22.86 | v60.2,26.14 60.2,25.25 59.55,24.6 59.55,23.74 59.3,23.49 U1.25 56.02,23.5 55.55,23.96 55.55,24.93 50.69,29.79 45.53,29.79 v43.81,28.08 | v64.88,16.95 65.8,16.95 66.18,17.34 67.89,17.34 v68.54,16.69
  Bottom 0.152: v35.25,22.86 37.19,24.8 40.53,24.8 v43.81,28.08 | v60.2,26.14 58.29,24.23 58.29,19.39 58.79,18.9 64.08,18.9 64.35,18.63 64.35,17.37 64.77,16.95 v64.88,16.95 | v68.54,16.69 71.74,13.49 73.5,13.49 74.37,12.61 81.08,12.61 81.76,11.93 81.76,9.41 80.78,8.43 POWER.4
CAN-12V  (via drill 0.35)
  Top 0.305: NMEA2000.1 95.15,36.04 95.15,15.47 93.97,14.29 90.75,14.29 87.82,11.35 D2.A 87.66,11.33 v86.37,12.61
  Bottom 0.305: JP2.2 86.36,12.62 v86.37,12.61
FTDI-5V  (via drill 0.35)
  Top 0.305: v46.44,18.94 46.41,18.9 45.21,18.9 D5.A
  Bottom 0.305: FTDI.3 61.77,38.23 46.44,22.9 v46.44,18.94
GND  (via drill 0.35)
  Top 0.152: Z2.A 29.26,17.5 29.26,12.36 28.36,11.47 27.01,11.47 26.52,10.97 26.52,7.85 26.28,7.61 | R32.1 55.45,2.55 49.99,2.55 49.87,2.67 v49.8,2.67 | v49.84,8.08 49.84,9.99 C19.1 | C8.2 87.02,16.23 | 83.44,15.86 U3.1 | U1.1 41,40
  Top 0.305: 52.65,18.33 52.65,17.75 50.71,15.81 42.99,15.81 C20.- 42.16,13.23 43.69,11.71 D6.A | 52.65,18.33 52.65,18.86 51.36,20.16 44.01,20.16 43.47,20.69 | 43.47,20.69 43.02,21.14 43.02,29.72 45.58,32.28 U1.THERM 48.11,39.1 47.21,40 | 39.43,40.01 39.2,40.23 39.2,44.77 38.57,45.4 C10.2 C9.2 | C7.2 28.64,43.18 | 28.64,43.18 RESET.2 26.84,43.18 26.33,42.67 OK1.5 23.81,42.67 23.74,42.6 23.74,37.72 25.3,37.72 26.4,36.61 26.4,35.13 | 34.75,42.01 35.76,42.01 36.16,41.6 36.13,41.58 T3.2 T4.2 T2.2 R35.1 | 34.75,42.01 32.33,42.01 32.31,41.99 29.84,41.99 28.64,43.18 | 26.4,35.13 26.54,34.99 C13.2 | 26.4,35.13 26.4,33.76 | OK2.5 26.05,33.4 26.4,33.76 | 26.4,33.76 27.59,32.57 C12.2 | 64.5,33.15 FTDI.1 61.04,33.15 60.27,33.91 60.27,39 59.27,40 U1.38 47.21,40 | 64.5,33.15 65.66,34.3 65.66,36.82 H1.GND3 68.37,36.84 69.64,35.58 79.02,35.58 80.29,36.84 H1.GND2 81.13,47.11 81.23,47.21 91.61,47.21 NMEA2000.4 | 64.5,33.15 66.56,31.09 66.56,27.27 H1.GND4 | 52.65,18.33 75.4,18.33 76.66,19.58 | JP2.3 83.86,21.07 82.83,20.04 77.11,20.04 76.66,19.58 | 76.66,22.44 76.66,24.15 76.89,24.38 | 76.66,22.44 76.66,20.12 | 76.66,20.12 76.66,19.58 | 76.89,24.38 80.54,24.38 81.16,25 81.16,27.22 H1.GND1 | U2.2 90.09,33.78 90.47,34.16 | 90.47,34.16 91.36,35.05 U2.8 | v93.92,29.98 93.92,28.96 C1.2 C2.2 | v91.36,32.99 90.47,33.88 90.47,34.16 | H1.6 76.63,24.64 76.89,24.38 | 39.43,40.01 U1.1 | U1.1 | U1.15 43.9,21.11 43.47,20.69 | U1.1 41.76,40.01 | 41,40 47.21,40 | C22.2 76.09,20.69 76.66,20.12 | C21.2 76.12,22.97 76.66,22.44 | U6.1 24.13,4.22 25.27,3.07 26.14,3.07 | 26.14,3.07 PWR.1 | R22.1 30.35,10.67 29.41,10.67 28.84,10.1 28.84,8.53 27.91,7.61 Z1.1 26.28,7.61 25.57,6.9 25.57,3.65 26.14,3.07
  Top 0.305: C6.2 61.33,8.12 U4.1 61.27,9.27 C5.2 57.16,13.37 55.55,13.37 54.22,12.04 49.03,12.04 48.96,12.12 | GND.2 GND.4 GND.6 GND.8 GND.7 GND.5 GND.3 GND.1 | 39.43,40.01 38.97,39.54 v38.89,39.54 | v35.17,41.22 35.17,41.59 34.75,42.01 | 87.02,16.23 86.03,17.22 U3.6 U3.7 | C8.2 87.59,14.4 88.05,13.95 | v88.7,13.3 88.05,13.95 | 88.05,13.95 84.39,13.95 83.44,14.9 83.44,15.86
  Top 0.508: D6.A 42.81,9.56 42.06,9.56 41.22,8.72 41.22,7.43 40.54,6.74 C3.2 40.54,4.72 40.8,4.46 U7.2 | D6.A 41.83,10.44 v40.73,11.54 38.71,13.56 v38.71,14.97 | C19.1 49.86,11.21 48.96,12.12 44.5,12.12 43.69,11.3 D6.A
  Bottom 0.152: v49.84,8.08 49.8,8.04 v49.8,2.67
  Bottom 0.305: JP2.3 83.86,28.31 85.57,30.02 90.49,30.02 90.7,30.23 | 90.7,30.23 91.36,30.9 v91.36,32.99 | 90.7,30.23 93.67,30.23 v93.92,29.98 | v38.89,39.54 36.85,39.54 v35.17,41.22 | v88.7,13.3 89.99,12 GND.8 | v38.71,18.06 v38.71,14.97
  Bottom 0.406: GND.2 88.27,1.22 29.52,1.22 PWR.1
  Bottom 0.508: v40.73,11.54 36.77,11.54 28.3,3.07 PWR.1
  pour Top: 22.52,48.39 39.97,48.39 39.97,40.96 40.35,40.58 58.67,40.58 58.79,40.69 59.13,41.03 59.13,47.28 60.12,48.27 96.51,48.27 96.51,0 22.4,0 22.4,48.23 22.52,48.35
  pour Bottom: 22.56,48.31 39.2,48.31 40.01,47.51 40.01,40.77 40.23,40.54 58.52,40.54 59.09,41.11 59.09,47.32 60.05,48.27 96.62,48.27 96.62,0.08 22.56,0.08
GNDI
  Top 0.152: TX-DISABLE.1 10.58,26.33 11.23,26.98
  Top 0.305: 13.97,13.97 13.97,7.62 15.24,6.35 17.78,6.35 U6.3 17.78,8.89 17.78,24.13 OK3.5 13.91,24.13 C17.2 | 13.97,13.97 14.86,14.86 OK4.5 | 13.97,13.97 13.46,14.48 C18.2 12.89,16.2 12.19,16.89 12.19,18.72 11.23,19.68 11.23,26.98 11.23,30.29 8.37,33.15 6.99,33.15 6.04,34.1 C11.2 6.45,34.71 6.45,38.05 6.76,38.35 6.76,44.98 7.62,45.85 U5.8
  pour Top: 19.77,0.04 -0.04,0.04 -0.04,48.54 20,48.54 20.12,48.65 20.12,0.34 19.77,0
  pour Bottom: 0.11,48.39 20.12,48.39 20.27,0.08 20.15,-0.04 0.15,-0.04 0,0.11 0,48.12 0.23,48.35
INT1  (via drill 0.35)
  Top 0.152: 84.96,15.87 U3.4 84.95,14.72 v84.96,14.7 | v79.55,14.52 79.92,14.88 R8.1 | v77.28,19.24 77.76,18.75 v77.76,14.97 | v53.91,19.96 54.33,19.54 v60.23,19.54 | v42.41,31.36 42.41,34.52 42,34.92 U1.5 | v49.68,24.08 v45.38,28.38
  Bottom 0.152: v77.76,14.97 78.22,14.52 v79.55,14.52 84.78,14.52 v84.96,14.7 | v77.28,19.24 76.97,19.55 v60.24,19.55 v60.23,19.54 | v53.91,19.96 49.8,24.08 v49.68,24.08 | v45.38,28.38 v42.41,31.36
IP_CUR_3V3_H  (via drill 0.35)
  Top 0.152: v66.86,15.16 66.29,15.73 61.53,15.73 v60.96,15.17 | R29.2 53.71,14.25 v55.7,14.25
  Top 0.305: D5.K D4.K D7.K
  Top 0.406: D7.K 53.38,14.28 R29.2
  Bottom 0.152: POWER.7 73.28,13.11 68.92,13.11 v66.86,15.16 | v60.96,15.17 56.58,15.17 55.7,14.29 v55.7,14.25
IP_CUR_3V3_L  (via drill 0.35)
  Top 0.152: v65.8,5.79 65.84,5.83 65.84,8.34 | v69.46,5.79 72.77,5.79 POWER.8
  Top 0.305: U4.3 65.84,8.34 65.84,9.83 64.92,10.74 61.69,10.74 C5.1 58.31,15.19 57.65,15.85 R29.1
  Bottom 0.152: v69.46,5.79 v65.8,5.79
IP_CUR_5V_H  (via drill 0.35)
  Top 0.152: v38.9,10.59 37.95,9.64 R34.2
  Top 0.305: T1.C 32.98,16.42 33.31,16.09 33.81,16.09 R20.2 36.5,13.41 36.5,7.29 D3.K 37.53,8.08 37.95,8.5 R34.2
  Bottom 0.152: POWER.5 76.4,9.42 69.92,9.42 69.91,9.41 60.92,9.41 60.27,8.76 40.04,8.76 38.9,9.91 v38.9,10.59
IP_CUR_5V_L
  Top 0.152: POWER.6 71.45,1.93 43.74,1.93 43.17,2.5 43.17,2.71
  Top 0.508: U7.5 U7.4 43.95,2.71 43.17,2.71 40.74,2.71 C3.1 39.46,2.9 38.98,3.39 38.98,7.2 39.75,7.97 R34.1
IP_CUR_H
  Top 0.152: D2.K 84.26,10.97 POWER.1
  Top 0.305: D2.K 87.82,4.04 84.98,1.21 34.44,1.21 | D1.K 33.22,1.21 34.44,1.21 | R26.2 34.78,1.55 34.44,1.21
IP_CUR_L
  Top 0.152: POWER.2 76.19,1.59 38.29,1.59 D3.A
  Top 0.305: R21.2 32.53,10.73 R27.2 33.38,7.85 33.38,4.84 33.85,4.37 R26.1 36.1,4.37 37.53,2.94 D3.A
N$1  (via drill 0.35)
  Top 0.152: NMEA2000.2 91.94,40.64 90.88,39.58 90.88,37.42 92.15,36.16 93.73,36.16 94.33,35.56 94.33,34.62 93.49,33.78 U2.7 92.47,32.78 92.47,31.2 90.6,29.34 89.02,29.34 88.96,29.34 v86.33,29.34 | R1.2 90.28,21.46 v90.26,21.49
  Bottom 0.152: v86.33,29.34 86.36,29.31 JP2.4 86.36,25.74 85.13,24.51 85.13,23.49 85.89,22.73 86.87,22.73 88.11,21.49 v90.26,21.49
N$2  (via drill 0.35)
  Top 0.152: NMEA2000.3 94.67,43.18 95.22,42.62 95.22,39.87 94.68,39.32 91.57,39.32 91.19,38.94 91.19,37.55 92.27,36.46 94.19,36.46 94.77,35.88 94.77,33.01 94.27,32.51 U2.6 94.77,31.21 94.77,25.64 94.16,25.03 92.28,25.03 91.95,24.7 SJ1.1 90.46,25.49 89.77,25.49 88.97,26.29 88.97,27.43 v89.08,27.55
  Bottom 0.152: v89.08,27.55 89.08,26.72 JP2.5
N$3
  Top 0.152: SJ1.2 93.47,21.65 R1.1
N$4
  Top 0.152: RESET.1 29.46,45.72 30.02,46.28 32.27,46.28 R2.1 31.25,43.5 C7.1 31.99,42.37 32.15,42.37 32.17,42.39 35.91,42.39 36.54,41.76 36.54,39.7 38.77,37.47 U1.3
N$6  (via drill 0.35)
  Top 0.152: v55.85,28.35 55.85,26.71 56.53,26.04 U1.27 | v88.09,36.12 88.07,36.1 U2.1 89.8,36.79 89.8,45.23 89.31,45.72 CAN.2
  Bottom 0.152: v55.85,28.35 55.85,29.03 58.6,31.77 85.42,31.77 86.68,33.03 86.68,34.71 v88.09,36.12
N$7  (via drill 0.35)
  Top 0.152: v56.73,28.99 56.73,27.81 57.24,27.3 U1.28 | v86.6,31.47 86.83,31.24 U2.4 87.78,31.24 86.11,32.92 86.11,41.95 87.34,43.18 CAN.1
  Bottom 0.152: v56.73,28.99 59.21,31.47 v86.6,31.47
N$10  (via drill 0.35)
  Top 0.152: T4.3 35.18,34.38 v35.2,34.4 | v37.19,32.99 37.19,25.38 38.5,24.06 40.28,24.06 U1.14 41.25,23.09 41.25,20.11 v41.22,20.08 | v76.66,33.22 76.66,32.36 71.13,26.83 H1.1 71.13,24 70.64,23.51 67.78,23.51 64.05,27.24 R11.1 63.6,27.75 v64.39,28.54
  Bottom 0.152: v35.2,34.4 36.61,32.99 v37.19,32.99 | v41.22,20.08 41.19,20.04 41.19,18.59 41.45,18.33 50.69,18.33 52.17,16.84 55.42,16.84 55.97,17.39 55.97,26.86 57.65,28.54 v64.39,28.54 | v76.66,33.22 79.7,33.22 82.45,35.97 84.2,37.72 SDIO.3
N$11  (via drill 0.35)
  Top 0.152: R10.1 61.77,29.98 v60.2,29.98 59.97,29.98 59.59,29.6 59.59,25.07 59.28,24.77 U1.26 | v81.5,30.75 81.27,30.98 81.27,33.95 82.88,35.56 SDIO.2 | v78.6,27.85 78.83,27.62 H1.8
  Bottom 0.152: v60.2,29.98 61.38,31.17 79.55,31.17 | v81.5,30.75 81.08,31.17 79.55,31.17 | v78.6,27.85 78.6,30.21 79.55,31.17
N$13
  Top 0.152: OK1.2 15.68,43.24 16.66,44.23 16.66,46.2 15.87,46.99 12.65,46.99 12,46.34 12,40.84 10.65,39.5 U5.3
N$14
  Top 0.152: OK2.2 17.82,33.4 18.4,33.98 18.4,46.46 17.56,47.3 12.17,47.3 11.7,46.83 11.7,42.48 11.25,42.04 U5.5
N$15
  Top 0.305: R4.1 15.61,45.4 OK1.1
N$16
  Top 0.305: R3.1 15.74,35.88 OK2.1
N$17  (via drill 0.35)
  Top 0.2: U5.2 8.51,38.23 v8.13,38.61
  Bottom 0.152: v8.13,38.61 6.73,38.61 6.5,38.84 6.5,39.62 5.11,41.02 5.11,42.74 5.98,43.61 5.98,46.23 5.55,46.66 2.03,46.66 1.92,46.55 1.92,28.34 4.15,26.1 4.15,3.28 4.65,2.78 N0183-RX.4
N$18  (via drill 0.35)
  Top 0.2: U5.1 7.94,36.96 v7.15,37.74
  Bottom 0.152: v7.15,37.74 6.2,38.7 6.2,39.49 4.8,40.89 4.8,42.86 5.67,43.74 5.67,46.1 5.42,46.35 2.22,46.35 2.22,28.46 4.46,26.23 4.46,5.79 4.93,5.32 N0183-RX.3
N$19  (via drill 0.35)
  Top 0.2: U5.6 8.76,43.31 v8.38,42.93
  Bottom 0.152: v8.38,42.93 7.96,42.93 7.05,43.84 7.05,46.39 6.48,46.97 1.87,46.97 1.61,46.71 1.61,28.21 3.85,25.97 3.85,3.13 5.19,1.79 7.54,1.79 8.12,2.37 8.12,6.93 7.19,7.86 N0183-RX.2
N$20  (via drill 0.35)
  Top 0.152: U5.7 8.27,44.58 v7.73,44.04
  Bottom 0.152: v7.73,44.04 7.73,46.14 6.6,47.27 1.74,47.27 1.31,46.84 1.31,28.08 3.54,25.85 3.54,3.01 5.06,1.49 7.66,1.49 8.42,2.25 8.42,7.06 8.38,7.1 8.38,9.75 7.73,10.4 N0183-RX.1
N$21  (via drill 0.35)
  Top 0.152: U5.12 6.01,42.04 v6.02,42.02 | v8.76,41.26 9.26,40.77 U5.4 | TX-DISABLE.2 5.18,26.33 4.84,26.67 4.84,29.98 | 4.84,29.98 4.84,31.7 4.3,32.23 v3.54,32.23 | 4.84,29.98 5.37,29.45 TX-ENABLE.1 TX-ENABLE.2 7.96,31.17 6.44,32.69 4.84,32.69 3.48,34.05 U5.16
  Top 0.305: U6.4 17.32,8.43 17.32,12.32 | 17.32,12.32 17.32,20.79 16.52,21.59 OK3.6 14.16,21.59 R17.2 12.51,22.29 11.68,23.11 | 17.32,12.32 OK4.6 | R18.2 C17.1 12.38,26.48 11.68,25.78 | 11.68,25.78 11.68,23.11 | 11.68,23.11 11.68,19.87 C18.1 | 11.68,25.78 11.68,30.48 | 11.68,30.48 11.68,32.2 | R3.2 11.68,32.2 | 11.68,32.2 11.68,33.15 | 11.68,33.15 11.68,37.38 13.46,39.16 R4.2 | 11.68,30.48 7.93,34.23 C11.1 | v5.37,36.98 5.35,36.96 U5.16 | v10.67,34.16 11.68,33.15
  Bottom 0.152: v6.02,42.02 8,42.02 v8.76,41.26 8.76,37.72 8.12,37.07 6.33,37.07 5.75,37.64 4.84,37.64 3.54,36.35 v3.54,32.23
  Bottom 0.305: v5.37,36.98 6.29,36.07 8.76,36.07 v10.67,34.16
N$22  (via drill 0.35)
  Top 0.152: T3.3 35.18,39.29 v35.24,39.36 | v47.32,28.42 51.59,28.42 55.24,24.77 55.24,22.36 55.17,22.29 55.32,22.29 U1.24 59.54,22.24 v60.16,22.86 | v76.35,27.89 77.31,27.89 77.76,27.44 77.76,26.27 H1.7 | SDIO.1 84.2,30.52 82.94,29.26 v75.67,29.26 | v66.18,20.65 66.15,20.62 R9.1
  Bottom 0.152: v35.24,39.36 36.39,39.36 v47.32,28.42 | v60.16,22.86 68.66,22.86 | 68.66,22.86 70.07,22.86 75.09,27.89 v76.35,27.89 75.67,28.57 v75.67,29.26 | 68.66,22.86 66.45,20.65 v66.18,20.65
N$24  (via drill 0.35)
  Top 0.152: v60.2,24.16 60.77,23.59 60.77,21.09 59.53,19.85 55,19.85 54.13,20.73 46.06,20.73 45.17,21.62 U1.16 | v78.14,33.83 78.14,33.41 72.23,27.5 H1.2 72.23,24.64 70.79,23.2 66.37,23.2 66.18,23.39 v66.18,24.16 65.19,24.16 64.24,25.11 R12.1
  Bottom 0.152: v78.14,33.83 79.88,33.83 82.45,36.4 82.45,38.51 84.2,40.26 SDIO.4 | v60.2,24.16 v66.18,24.16
N$25  (via drill 0.35)
  Top 0.152: v81.15,22.86 R13.1 | v42.9,17.72 42.55,18.07 42.55,20.39 42.18,20.76 42.18,24.25 U1.13 | SDIO.5 82.41,41.39 82.41,35.52 80.89,34 80.89,30.1 81.92,30.1 v82.53,30.71 | H1.5 75.55,26.22 v75.55,24.8
  Bottom 0.152: v42.9,17.72 44.38,16.19 65.91,16.19 66.68,16.96 66.67,16.96 68.23,18.52 79.13,18.52 81.15,20.54 v81.15,22.86 81.35,23.05 81.35,24.8 | 81.35,24.8 82.07,25.52 82.07,30.25 v82.53,30.71 | v75.55,24.8 81.35,24.8
N$26  (via drill 0.35)
  Top 0.152: v59.28,20.46 54.9,20.46 54.06,21.31 U1.23 | v79.63,34.44 73.33,28.14 H1.3 73.33,25.29 70.94,22.9 67.28,22.9 | R14.1 67.28,22.9 | v66.18,21.75 67.28,22.86 67.28,22.9
  Bottom 0.152: v79.63,34.44 80.05,34.44 82.14,36.54 82.14,43.66 SDIO.6 | v59.28,20.46 60.58,21.75 v66.18,21.75
N$27
  Top 0.152: U5.14 3.1,39.5 1.97,38.37 1.97,15.37 3.89,13.45 N0183-TX.4
N$28
  Top 0.152: U5.13 3.14,40.77 1.66,39.29 1.66,15.24 4.45,12.46 7.62,12.46 8.2,13.04 8.2,14.99 8.27,15.05 7.33,15.99 N0183-TX.3
N$29
  Top 0.152: U5.10 2.29,44.58 1.69,43.98 1.69,41.68 1.99,41.38 4.34,41.38 6.38,39.34 6.38,38.51 5.48,37.62 2.71,37.62 2.3,37.2 2.3,23.44 3.04,22.71 7.54,22.71 8.34,21.91 8.34,18.94 7.94,18.53 N0183-TX.2
N$30
  Top 0.152: U5.11 4.18,43.31 4.37,43.49 4.37,45.05 4.24,45.19 2.43,45.19 1.36,44.11 1.36,15.11 4.32,12.15 7.75,12.15 8.57,12.98 8.57,16.99 8.27,17.3 4.88,17.3 4.46,17.72 4.46,20.31 5.22,21.07 N0183-TX.1
N$31
  Top 0.152: OK3.1 24.96,19.88 26.36,18.48 R15.1
N$32
  Top 0.152: R16.1 25.03,12.38 OK4.1
N$33  (via drill 0.35)
  Top 0.152: OK3.4 15.68,28.77 | 13.78,30.67 15.68,28.77 | 15.68,28.77 15.98,29.08 v16.26,29.08 | v5.59,39.24 4.57,38.23 U5.15
  Top 0.305: R18.1 13.78,30.67
  Bottom 0.152: v16.26,29.08 10.29,29.08 9.02,30.35 3.68,30.35 2.86,31.18 2.86,37.4 3.68,38.23 4.83,38.23 5.59,38.99 v5.59,39.24
N$34  (via drill 0.35)
  Top 0.152: OK4.4 15.68,18.61 15.24,19.05 | 15.24,19.05 13.9,20.39 | 15.24,19.05 15.88,19.68 v16,19.68 | U5.9 4.25,45.85 v5.07,45.03
  Top 0.305: 13.9,20.39 R17.1
  Bottom 0.152: v16,19.68 9.4,26.29 9.4,27.3 8.89,27.81 3.81,27.81 2.53,29.1 2.53,37.85 4.46,39.78 4.46,44.42 v5.07,45.03
N$35  (via drill 0.35)
  Top 0.152: LED1.C 32.38,39.05 v32.46,39.13 | v38.41,28.61 40.86,28.61 U1.10
  Bottom 0.152: v32.46,39.13 37.87,33.72 37.87,29.15 v38.41,28.61
N$36  (via drill 0.35)
  Top 0.152: LED2.C 32.5,33.78 v32.5,34.94 | v38.41,27.36 40.86,27.36 U1.11
  Bottom 0.152: v32.5,34.94 33.38,34.94 37.57,30.75 37.57,28.19 v38.41,27.36
N$37
  Top 0.152: T3.1 T4.1 T2.1 33.17,25.4 | 33.17,25.4 PROG.2 | R35.2 34.03,24.54 33.17,25.4
N$38  (via drill 0.35)
  Top 0.152: LED3.C 32.51,30.49 32.61,30.59 v32.61,30.63 | v38.41,26.02 U1.12
  Bottom 0.152: v32.61,30.63 33.8,30.63 v38.41,26.02
N$39
  Top 0.152: R23.2 32.31,36.59 LED1.A
N$40
  Top 0.152: R24.2 32.43,32.27 LED2.A
N$41
  Top 0.152: T1.B 32.03,15.98 R20.1 32.67,15.34 Z2.K
N$42
  Top 0.508: C23.P$1 42.58,7.6 42.22,7.24 42.22,5.54 U7.1
N$43
  Top 0.152: PROG.1 32.96,22.86 R31.1
N$44
  Top 0.152: R25.2 32.43,28.08 LED3.A
N$45
  Top 0.508: D6.K 47.6,8.05 47.08,7.53 47.08,5.41 | 47.08,5.41 L1.P$1 | 47.08,5.41 47.07,5.41 U7.6 44.75,6.52 C23.P$2
N$46
  Top 0.152: R22.2 32.56,12.66 R21.1 33.89,12.67 SJ3.2
N$48  (via drill 0.35)
  Top 0.152: C4.1 55.82,6.12 R30.1 55.78,4.58 R32.2 54.95,4.55 54.71,4.3 54.71,3.35 54.29,2.93 50.98,2.93 50.41,3.5 49.11,3.5 48.54,2.93 46.06,2.93 v45.72,2.59 | v43.62,3.77 43.36,3.51 U7.3
  Bottom 0.152: v45.72,2.59 44.39,2.59 43.62,3.35 v43.62,3.77
OP_CUR_3V3_H
  Top 0.152: POWER.11 71.88,9.42 75.82,9.42 76.4,8.84 76.4,8.12 76.4,8.02 76.4,7.94 70.7,2.23 61.68,2.23 61.33,2.59 C6.1
  Top 0.305: U4.2 63.68,8.05 R28.2 61.78,3.51 C6.1
OP_CUR_5V_H  (via drill 0.35)
  Top 0.152: R33.2 53.61,9.87 53.61,8.65 54.4,7.86 R30.2 58.37,7.86 C4.2 58.41,8.53 v59.63,9.75
  Top 0.508: L1.P$2 53.13,7.76 51.56,9.32 C19.2 51.6,9.98 R33.2
  Bottom 0.152: POWER.9 71.65,9.75 v59.63,9.75
RX1  (via drill 0.35)
  Top 0.152: OK1.4 26.86,40.13 R5.1 26.76,39.18 v26.29,38.71 | v38.56,33.68 40.86,33.68 U1.6
  Bottom 0.152: v26.29,38.71 27.66,40.08 33.11,40.08 38.56,34.63 v38.56,33.68
RX2  (via drill 0.35)
  Top 0.152: OK2.4 25.12,30.71 v26.29,30.71 | v27.81,23.96 R6.1 | v38.63,32.35 40.85,32.35 U1.7
  Bottom 0.152: v26.29,30.71 26.29,25.49 v27.81,23.96 28.69,23.96 28.99,24.27 28.99,26.21 29.79,27.01 36.56,27.01 38.15,25.42 38.66,25.42 38.99,25.75 39.01,25.75 39.01,31.97 v38.63,32.35
RXDATA  (via drill 0.35)
  Top 0.152: v54.03,36.99 54.67,36.35 54.67,36.31 54.79,36.19 U1.35
  Bottom 0.152: v54.03,36.99 57.72,40.69 58.56,40.69 61.18,43.31 FTDI.5
SCAP
  Top 0.152: JP3.1 36.76,18.97 R19.1
  Top 0.305: R19.1 36.24,18.97 36.96,18.25 36.96,15.11 | 36.96,15.11 C20.+ | D4.A 46.51,16.84 38.68,16.84 36.96,15.11
SCAPDRV
  Top 0.152: T1.E 33.93,19.76 34.21,20.04 36.54,20.04 37.11,20.61 37.11,21.83 JP1.1
  Top 0.305: T1.E 35.58,17.1 R19.2
SCL  (via drill 0.35)
  Top 0.152: v62.29,17.64 73.03,17.64 I2C.1 | v56.69,25.38 56.01,25.38 51.67,29.71 51.67,33.15 52.17,33.66 54.12,33.66 54.13,33.65 U1.33 | R7.1 90.07,15.96 v88.81,14.71 | v87.36,13.26 87.33,13.3 80.54,13.3 v80.5,13.34 80.5,14.44 81.92,15.85 81.92,16.46 82.18,16.72 U3.14
  Bottom 0.152: v62.29,17.64 v62.28,17.63 62.27,17.64 57.87,17.64 57.22,18.29 57.22,24.46 56.69,24.99 v56.69,25.38 | v88.81,14.71 v87.36,13.26 | v80.5,13.34 77.34,13.34 I2C.1
SDA  (via drill 0.35)
  Top 0.152: v56.61,24.21 56.61,24.3 51.36,29.55 51.36,36.83 52.52,37.99 56.73,37.99 57.26,37.46 U1.36 | v61.15,16.8 62.26,16.8 63.02,16.04 65.42,16.04 66.25,16.88 67.16,16.88 68.59,15.44 I2C.2 | U3.13 v81.24,17.22 v81.23,17.23 | R36.1 94.15,16.27 94.3,16.42 94.3,19.16 93.65,19.81 v90.91,19.81 | v87.33,19.81 85.55,19.81 v85.54,19.82
  Bottom 0.152: v61.15,16.8 58.26,16.8 56.88,18.18 56.88,23.94 v56.61,24.21 | I2C.2 74.48,17.23 v81.23,17.23 83.81,19.81 85.19,19.81 85.2,19.82 v85.54,19.82 | v90.91,19.81 v87.33,19.81
TX1  (via drill 0.35)
  Top 0.152: v53.26,32.04 55.46,29.84 U1.30 | OK3.2 25.09,24.13 v26.41,22.82
  Bottom 0.152: v53.26,32.04 51.89,32.04 40.27,20.42 40.27,14.36 39.28,13.37 27.96,13.37 27.05,14.29 27.05,16.94 26.41,17.58 v26.41,22.82
TX2  (via drill 0.35)
  Top 0.152: v54.33,32.7 55.92,31.11 U1.31 | v26.44,16.69 24.96,15.21 OK4.2
  Bottom 0.152: v54.33,32.7 54.33,32.17 42.84,20.69 40.97,20.69 40.58,20.29 40.58,14.21 39.43,13.07 26.44,13.07 26.1,13.41 26.1,16.34 v26.44,16.69
TXDATA  (via drill 0.35)
  Top 0.152: U1.34 53.97,34.92 v53.42,35.47
  Bottom 0.152: v53.42,35.47 58.14,40.2 61.78,40.2 FTDI.4
VSENSE  (via drill 0.35)
  Top 0.152: 35.97,10.67 35.97,12.8 34.79,13.98 32.3,13.98 32.26,14.02 v31.39,14.02 | 35.97,10.67 35.97,6.74 35.89,6.67 | v38.56,35.97 38.78,36.19 U1.4 | 35.89,6.67 SJ2.1 SJ2.2 34.06,8.19 33.6,8.65 33.6,11.47 33.41,11.66 31.66,11.66 31.47,11.47 | SJ3.1 35.55,10.25 35.97,10.67 | 35.89,6.67 35.89,5.83 v37.49,4.23 | R27.1 31.47,9.52 31.47,11.47 | 31.47,11.47 31.28,11.66 29.38,11.66 28.47,10.76 Z1.2
  Bottom 0.152: v31.39,14.02 31.39,20.61 35.89,25.11 38.8,25.11 39.32,25.63 39.32,35.21 v38.56,35.97 | v37.49,4.23 41.49,4.23 43.78,1.94 74.03,1.94 79.25,7.16 79.25,9.87 80.35,10.97 POWER.3

### Text on the board
tPlace: TX | CMD | GND | RX | L | CLK | RX | TX | D3 | H | 5V | D2 | +12V | D1 | GND | D0 | TX2B | TX2A | CLK | DAT | TX1B | TX1A | RX2B | RX2A | +12V | RX1B | GND | RX1A | WIBL - V2.4 / 2022-04-23
bPlace: (c) 2022 Center for Coastal and Ocean Mapping / University of New Hampshire / 2022-04-23 V2.4
tNames: U5 | JLCJLCJLCJLC | D5 | D4 | D7 | D7 | Z2 | VSENSE | D6 | OP-3V3 | OP-5V | IP-3V3 | IP-5V | BOOT | IP | D2 | D1 | D3